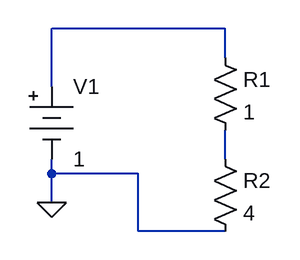
[diagram p0: schematic Draft6.asc]
Draft6.asc, the LTspice schematic file:
Version 4
SHEET 1 880 680
WIRE 272 32 80 32
WIRE 272 64 272 32
WIRE 80 96 80 32
WIRE 272 176 272 144
WIRE 80 192 80 176
WIRE 176 192 80 192
WIRE 80 224 80 192
WIRE 176 256 176 192
WIRE 272 256 176 256
FLAG 80 224 0
SYMBOL Misc\\battery 80 80 R0
SYMATTR InstName V1
SYMATTR Value 1
SYMBOL res 256 48 R0
SYMATTR InstName R1
SYMATTR Value 1
SYMBOL res 256 160 R0
SYMATTR InstName R2
SYMATTR Value 4

The netlist it stands for:
* Draft6.asc
V1 N001 0 1
R1 N001 N002 1
R2 N002 0 4
.backanno
.end